# EAGLE design ads1231 (EAGLE 7.6.0)
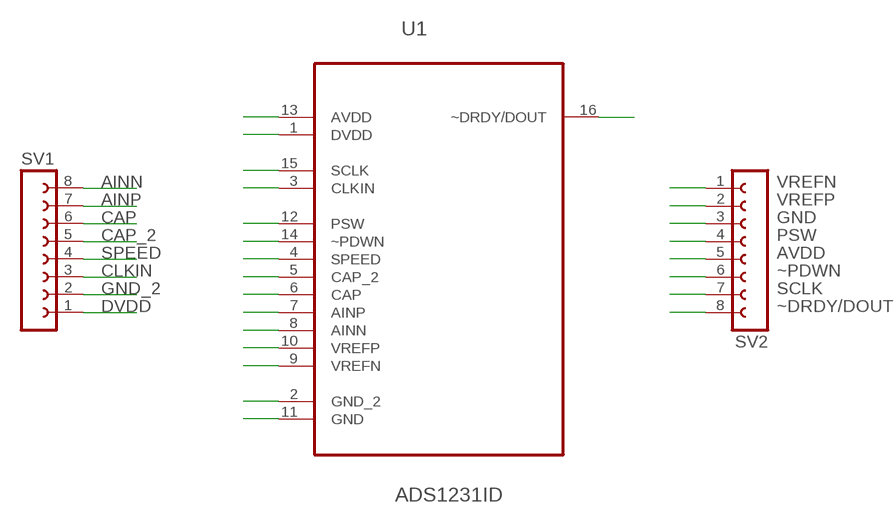
[diagram p0: schematic, sheet 1]

## Parts
SV1  FE08-1  [FE08]
SV2  FE08-1  [FE08]
U1  ADS1231ID  [SOIC127P600X175-16N]

## Nets
AINN: SV1.8 U1.8(AINN)
AINP: SV1.7 U1.7(AINP)
AVDD: SV2.5 U1.13(AVDD)
CAP: SV1.6 U1.6(CAP)
CAP_2: SV1.5 U1.5(CAP_2)
CLKIN: SV1.3 U1.3(CLKIN)
DVDD: SV1.1 U1.1(DVDD)
GND: SV2.3 U1.11(GND)
GND_2: SV1.2 U1.2(GND_2)
PSW: SV2.4 U1.12(PSW)
SCLK: SV2.7 U1.15(SCLK)
SPEED: SV1.4 U1.4(SPEED)
VREFN: SV2.1 U1.9(VREFN)
VREFP: SV2.2 U1.10(VREFP)
~DRDY/DOUT: SV2.8 U1.16(~DRDY/DOUT)
~PDWN: SV2.6 U1.14(~PDWN)

## Library data of the parts
SV1 SV2 = con-lsta:FE08-1: FEMALE HEADER; OC_FARNELL: unknown; OC_NEWARK: unknown
U1 = Texas Instruments_By_element14_Batch_1:ADS1231ID: ADC; MPN: ADS1231ID; OC_FARNELL: 1882261; OC_NEWARK: 27T6158; PACKAGE: SOIC-16; SUPPLIER: Texas Instruments

## Board
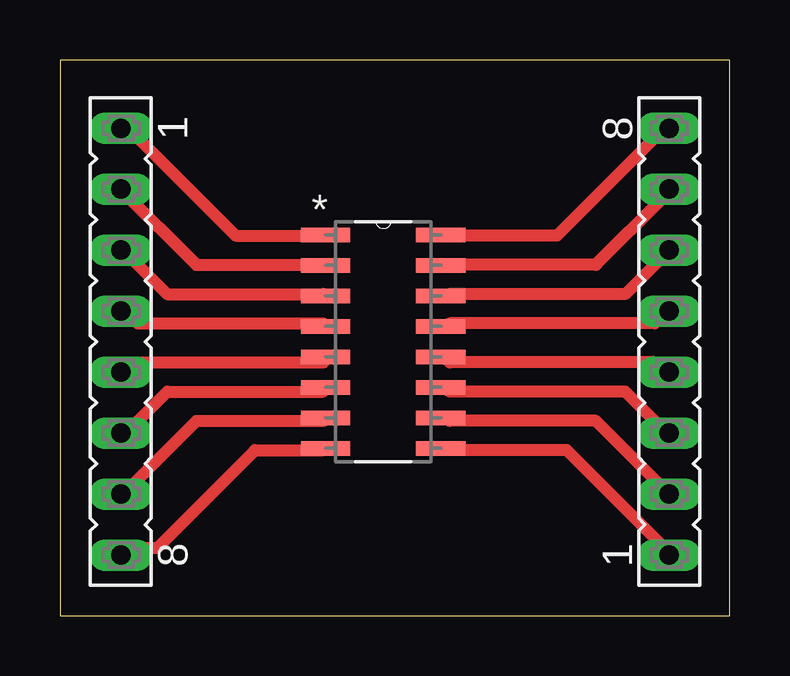
[diagram p1: board, top side]

Size 27.92 x 23.16 mm. Coordinates in mm from the lower left corner, seen from the top.
Outline: 0,0 27.92,0 27.92,23.16 0,23.16 0,0
Copper layers (1*16): Top 0.035mm / dielectric 1.5mm / Bottom 0.035mm
Design rules "default *": minimum track width 20mil, minimum drill 24mil, track to track 12mil, track to pad 12mil, pad to pad 12mil, via to via 12mil, smd to smd 12mil, copper to edge 40mil, drill to drill 8mil, minimum pad ring 10mil, minimum via ring 8mil, stop-mask expansion 4mil, vias tented up to drill 0mil, thermal gap 10mil

### Footprints (pad centres in the part's own frame; a part is rotated, then mirrored left to right if it is on the bottom)
FE08 = drill 0.813 long: 1 -8.89,0; 2 -6.35,0; 3 -3.81,0; 4 -1.27,0; 5 1.27,0; 6 3.81,0; 7 6.35,0; 8 8.89,0
SOIC127P600X175-16N = smd 2.057 x 0.61: 1 -4.801,8.89; 2 -4.801,7.62; 3 -4.801,6.35; 4 -4.801,5.08; 5 -4.801,3.81; 6 -4.801,2.54; 7 -4.801,1.27; 8 -4.801,0; 9 0,0; 10 0,1.27; 11 0,2.54; 12 0,3.81; 13 0,5.08; 14 0,6.35; 15 0,7.62; 16 0,8.89

### Placement (x,y rotation side)
SV1  2.54,11.43 270 top
SV2  25.4,11.43 90 top
U1  15.88,6.99 0 top

### Tracks (layer width: path | path; a pad name or v marks a point on that pad's centre or on a via)
AINN
  Top 0.508: U1.8 10.97,6.91 8.13,6.91 4.06,2.85 2.85,2.85 SV1.8
AINP
  Top 0.508: U1.7 10.97,8.13 5.69,8.13 2.85,5.28 SV1.7
AVDD
  Top 0.508: U1.13 16.26,12.19 24.79,12.19 25.2,12.6 SV2.5
CAP
  Top 0.508: U1.6 10.97,9.35 4.47,9.35 2.85,7.72 SV1.6
CAP_2
  Top 0.508: U1.5 10.97,10.57 3.25,10.57 2.85,10.16 SV1.5
CLKIN
  Top 0.508: U1.3 10.97,13.41 4.47,13.41 2.85,15.04 SV1.3
DVDD
  Top 0.508: U1.1 10.97,15.85 7.32,15.85 2.85,20.32 SV1.1
GND
  Top 0.508: U1.11 16.26,9.35 23.57,9.35 25.2,7.72 SV2.3
GND_2
  Top 0.508: SV1.2 5.69,14.63 10.97,14.63 U1.2
PSW
  Top 0.508: U1.12 16.26,10.57 24.79,10.57 25.2,10.16 SV2.4
SCLK
  Top 0.508: U1.15 16.26,14.63 22.35,14.63 25.2,17.48 SV2.7
SPEED
  Top 0.508: U1.4 10.97,12.19 3.25,12.19 2.85,12.6 SV1.4
VREFN
  Top 0.508: U1.9 16.26,6.91 21.13,6.91 25.2,2.85 SV2.1
VREFP
  Top 0.508: SV2.2 22.35,8.13 16.26,8.13 U1.10
~DRDY/DOUT
  Top 0.508: U1.16 16.26,15.85 20.73,15.85 25.2,20.32 SV2.8
~PDWN
  Top 0.508: SV2.6 23.57,13.41 16.26,13.41 U1.14